# Altium schematic sheet AD9959.SchDoc: AD9959 4-Channel 500M DDS Module
size A3; Date: 2022.4.26; ApprovedBy: Pablo; CheckedBy: Pablo; Author: Pablo; CompanyName: STI; DrawnBy: Pablo; Engineer: Pablo; Organization: STI; DocumentNumber: 1; Revision: 1; SheetNumber: 1; SheetTotal: 1; Time: 2022.4.26
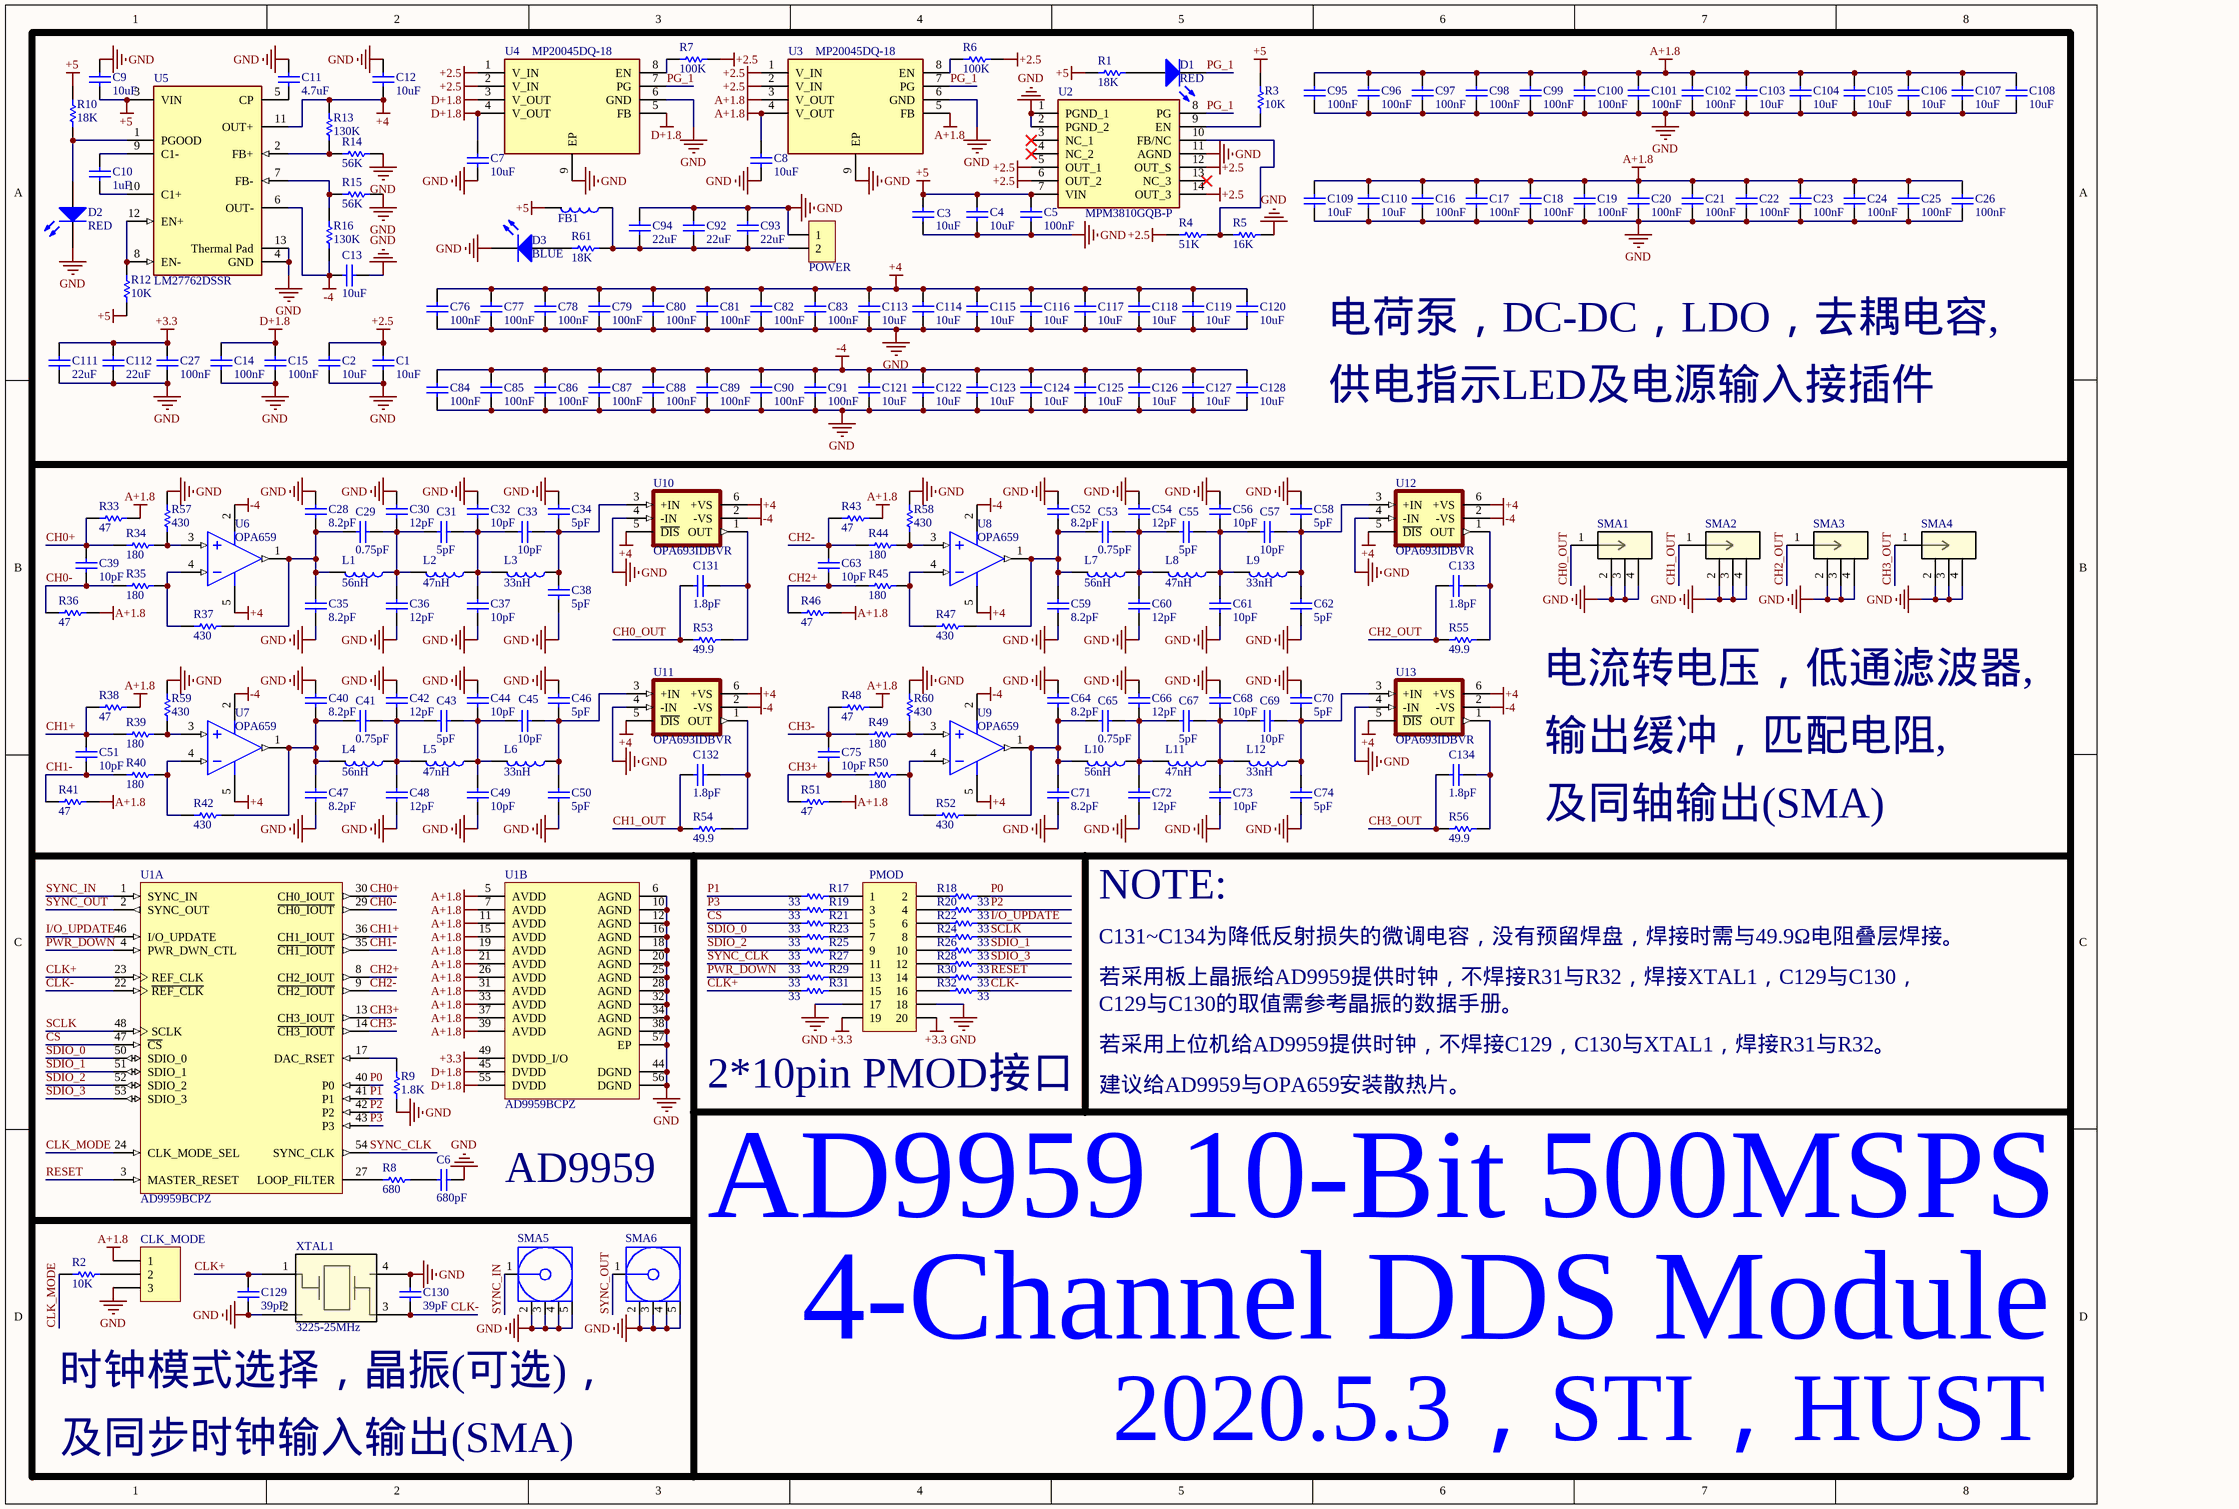
[diagram p0: AD9959.SchDoc]

## Parts
C1  10uF  [1608[0603]]
C2  10uF  [1608[0603]]
C3  10uF  [1608[0603]]
C4  10uF  [1608[0603]]
C5  100nF  [0402]
C6  680pF  [0402]
C7  10uF  [1608[0603]]
C8  10uF  [1608[0603]]
C9  10uF  [1608[0603]]
C10  1uF  [0402]
C11  4.7uF  [1608[0603]]
C12  10uF  [1608[0603]]
C13  10uF  [1608[0603]]
C14  100nF  [0402]
C15  100nF  [0402]
C16  100nF  [0402]
C17  100nF  [0402]
C18  100nF  [0402]
C19  100nF  [0402]
C20  100nF  [0402]
C21  100nF  [0402]
C22  100nF  [0402]
C23  100nF  [0402]
C24  100nF  [0402]
C25  100nF  [0402]
C26  100nF  [0402]
C27  100nF  [0402]
C28  8.2pF  [0402]
C29  0.75pF  [0402]
C30  12pF  [0402]
C31  5pF  [0402]
C32  10pF  [0402]
C33  10pF  [0402]
C34  5pF  [0402]
C35  8.2pF  [0402]
C36  12pF  [0402]
C37  10pF  [0402]
C38  5pF  [0402]
C39  10pF  [0402]
C40  8.2pF  [0402]
C41  0.75pF  [0402]
C42  12pF  [0402]
C43  5pF  [0402]
C44  10pF  [0402]
C45  10pF  [0402]
C46  5pF  [0402]
C47  8.2pF  [0402]
C48  12pF  [0402]
C49  10pF  [0402]
C50  5pF  [0402]
C51  10pF  [0402]
C52  8.2pF  [0402]
C53  0.75pF  [0402]
C54  12pF  [0402]
C55  5pF  [0402]
C56  10pF  [0402]
C57  10pF  [0402]
C58  5pF  [0402]
C59  8.2pF  [0402]
C60  12pF  [0402]
C61  10pF  [0402]
C62  5pF  [0402]
C63  10pF  [0402]
C64  8.2pF  [0402]
C65  0.75pF  [0402]
C66  12pF  [0402]
C67  5pF  [0402]
C68  10pF  [0402]
C69  10pF  [0402]
C70  5pF  [0402]
C71  8.2pF  [0402]
C72  12pF  [0402]
C73  10pF  [0402]
C74  5pF  [0402]
C75  10pF  [0402]
C76  100nF  [0402]
C77  100nF  [0402]
C78  100nF  [0402]
C79  100nF  [0402]
C80  100nF  [0402]
C81  100nF  [0402]
C82  100nF  [0402]
C83  100nF  [0402]
C84  100nF  [0402]
C85  100nF  [0402]
C86  100nF  [0402]
C87  100nF  [0402]
C88  100nF  [0402]
C89  100nF  [0402]
C90  100nF  [0402]
C91  100nF  [0402]
C92  22uF  [6-0805_L]
C93  22uF  [6-0805_L]
C94  22uF  [6-0805_L]
C95  100nF  [0402]
C96  100nF  [0402]
C97  100nF  [0402]
C98  100nF  [0402]
C99  100nF  [0402]
C100  100nF  [0402]
C101  100nF  [0402]
C102  100nF  [0402]
C103  10uF  [0402]
C104  10uF  [0402]
C105  10uF  [0402]
C106  10uF  [0402]
C107  10uF  [0402]
C108  10uF  [0402]
C109  10uF  [0402]
C110  10uF  [0402]
C111  22uF  [6-0805_L]
C112  22uF  [6-0805_L]
C113  10uF  [0402]
C114  10uF  [0402]
C115  10uF  [0402]
C116  10uF  [0402]
C117  10uF  [0402]
C118  10uF  [0402]
C119  10uF  [0402]
C120  10uF  [0402]
C121  10uF  [0402]
C122  10uF  [0402]
C123  10uF  [0402]
C124  10uF  [0402]
C125  10uF  [0402]
C126  10uF  [0402]
C127  10uF  [0402]
C128  10uF  [0402]
C129  39pF  [0402]
C130  39pF  [0402]
C131  1.8pF  [0402]
C132  1.8pF  [0402]
C133  1.8pF  [0402]
C134  1.8pF  [0402]
CLK_MODE  Header 3  [HDR1X3]  (value not drawn)
D1  RED  [1608[0603]]
D2  RED  [1608[0603]]
D3  BLUE  [1608[0603]]
FB1  100R,100MHz, 0603  [1608[0603]]  (value not drawn)
L1  56nH  [0402]
L2  47nH  [0402]
L3  33nH  [0402]
L4  56nH  [0402]
L5  47nH  [0402]
L6  33nH  [0402]
L7  56nH  [0402]
L8  47nH  [0402]
L9  33nH  [0402]
L10  56nH  [0402]
L11  47nH  [0402]
L12  33nH  [0402]
PMOD  Header 2X10  [201R2X10]  (value not drawn)
POWER  HDR-1X2  [KF2510-LI-2P]  (value not drawn)
R1  18K  [0402]
R2  10K  [0402]
R3  10K  [0402]
R4  51K  [0402]
R5  16K  [0402]
R6  100K  [0402]
R7  100K  [0402]
R8  680  [0402]
R9  1.8K  [0402]
R10  18K  [0402]
R12  10K  [0402]
R13  130K  [0402]
R14  56K  [0402]
R15  56K  [0402]
R16  130K  [0402]
R17  33  [0402]
R18  33  [0402]
R19  33  [0402]
R20  33  [0402]
R21  33  [0402]
R22  33  [0402]
R23  33  [0402]
R24  33  [0402]
R25  33  [0402]
R26  33  [0402]
R27  33  [0402]
R28  33  [0402]
R29  33  [0402]
R30  33  [0402]
R31  33  [0402]
R32  33  [0402]
R33  47  [0402]
R34  180  [0402]
R35  180  [0402]
R36  47  [0402]
R37  430  [0402]
R38  47  [0402]
R39  180  [0402]
R40  180  [0402]
R41  47  [0402]
R42  430  [0402]
R43  47  [0402]
R44  180  [0402]
R45  180  [0402]
R46  47  [0402]
R47  430  [0402]
R48  47  [0402]
R49  180  [0402]
R50  180  [0402]
R51  47  [0402]
R52  430  [0402]
R53  49.9  [0402]
R54  49.9  [0402]
R55  49.9  [0402]
R56  49.9  [0402]
R57  430  [0402]
R58  430  [0402]
R59  430  [0402]
R60  430  [0402]
R61  18K  [0402]
SMA1  132414  [CONN_132414_AMP]  (value not drawn)
SMA2  132414  [CONN_132414_AMP]  (value not drawn)
SMA3  132414  [CONN_132414_AMP]  (value not drawn)
SMA4  132414  [CONN_132414_AMP]  (value not drawn)
SMA5  5-1814832-1  [TECO-5-1814832-1_V]  (value not drawn)
SMA6  5-1814832-1  [TECO-5-1814832-1_V]  (value not drawn)
U1  AD9959BCPZ  [ADI-CP-56-1_L]  (parts A,B of 2)
U2  MPM3810GQB-P  [MPM3810GQB33Z]
U3  MP20045DQ-18  [SON65P300X300X100-9N]
U4  MP20045DQ-18  [SON65P300X300X100-9N]
U5  LM27762DSSR  [FP-DSS0012B-IPC_A]
U6  OPA659  [DBV0005A_L]
U7  OPA659  [DBV0005A_L]
U8  OPA659  [DBV0005A_L]
U9  OPA659  [DBV0005A_L]
U10  OPA693IDBVR  [SOT95P280X145-6N]
U11  OPA693IDBVR  [SOT95P280X145-6N]
U12  OPA693IDBVR  [SOT95P280X145-6N]
U13  OPA693IDBVR  [SOT95P280X145-6N]
XTAL1  3225-25MHz  [NX3225GA-16.000M-STD-CRG-2_NDK]

## Nets
+2.5: C1.2 C2.2 R4.2 R6.2 R7.2 U2.5(OUT_1) U2.6(OUT_2) U2.12(OUT_S) U2.14(OUT_3) U3.1(V_IN) U3.2(V_IN) U4.1(V_IN) U4.2(V_IN)
+3.3: C27.1 C111.1 C112.1 PMOD.19 PMOD.20 U1.49(DVDD_I/O)
+4: C12.1 C76.1 C77.1 C78.1 C79.1 C80.1 C81.1 C82.1 C83.1 C113.1 C114.1 C115.1 C116.1 C117.1 C118.1 C119.1 C120.1 R13.1 U5.11(OUT+) U6.5(VS+) U7.5(VS+) U8.5(VS+) U9.5(VS+) U10.5(~{DIS}) U10.6(+VS) U11.5(~{DIS}) U11.6(+VS) U12.5(~{DIS}) U12.6(+VS) U13.5(~{DIS}) U13.6(+VS)
+5: C3.1 C4.1 C5.1 C9.2 FB1.2 R1.2 R3.2 R10.2 R12.1 U2.7(VIN) U5.3(VIN)
-4: C13.2 C84.1 C85.1 C86.1 C87.1 C88.1 C89.1 C90.1 C91.1 C121.1 C122.1 C123.1 C124.1 C125.1 C126.1 C127.1 C128.1 R16.2 U5.6(OUT-) U6.2(VS-) U7.2(VS-) U8.2(VS-) U9.2(VS-) U10.2(-VS) U11.2(-VS) U12.2(-VS) U13.2(-VS)
A+1.8: C8.1 C16.1 C17.1 C18.1 C19.1 C20.1 C21.1 C22.1 C23.1 C24.1 C25.1 C26.1 C95.1 C96.1 C97.1 C98.1 C99.1 C100.1 C101.1 C102.1 C103.1 C104.1 C105.1 C106.1 C107.1 C108.1 C109.1 C110.1 CLK_MODE.1 R33.1 R36.2 R38.1 R41.2 R43.1 R46.2 R48.1 R51.2 U1.5(AVDD) U1.7(AVDD) U1.11(AVDD) U1.15(AVDD) U1.19(AVDD) U1.21(AVDD) U1.26(AVDD) U1.31(AVDD) U1.33(AVDD) U1.37(AVDD) U1.39(AVDD) U3.3(V_OUT) U3.4(V_OUT) U3.5(FB)
D+1.8: C7.1 C14.1 C15.1 U1.45(DVDD) U1.55(DVDD) U4.3(V_OUT) U4.4(V_OUT) U4.5(FB)
GND: C1.1 C2.1 C3.2 C4.2 C5.2 C6.1 C7.2 C8.2 C9.1 C11.2 C12.2 C13.1 C14.2 C15.2 C16.2 C17.2 C18.2 C19.2 C20.2 C21.2 C22.2 C23.2 C24.2 C25.2 C26.2 C27.2 C28.1 C30.1 C32.1 C34.2 C35.2 C36.2 C37.2 C38.1 C40.1 C42.1 C44.1 C46.2 C47.2 C48.2 C49.2 C50.1 C52.1 C54.1 C56.1 C58.2 C59.2 C60.2 C61.2 C62.1 C64.1 C66.1 C68.1 C70.2 C71.2 C72.2 C73.2 C74.1 C76.2 C77.2 C78.2 C79.2 C80.2 C81.2 C82.2 C83.2 C84.2 C85.2 C86.2 C87.2 C88.2 C89.2 C90.2 C91.2 C92.2 C93.2 C94.2 C95.2 C96.2 C97.2 C98.2 C99.2 C100.2 C101.2 C102.2 C103.2 C104.2 C105.2 C106.2 C107.2 C108.2 C109.2 C110.2 C111.2 C112.2 C113.2 C114.2 C115.2 C116.2 C117.2 C118.2 C119.2 C120.2 C121.2 C122.2 C123.2 C124.2 C125.2 C126.2 C127.2 C128.2 C129.1 C130.1 CLK_MODE.3 D2.2(K) D3.2(K) PMOD.17 PMOD.18 POWER.1 R5.1 R9.2 R14.1 R15.1 R57.2 R58.2 R59.2 R60.2 SMA1.2 SMA1.3 SMA1.4 SMA2.2 SMA2.3 SMA2.4 SMA3.2 SMA3.3 SMA3.4 SMA4.2 SMA4.3 SMA4.4 SMA5.2 SMA5.3 SMA5.4 SMA5.5 SMA6.2 SMA6.3 SMA6.4 SMA6.5 U1.6(AGND) U1.10(AGND) U1.12(AGND) U1.16(AGND) U1.18(AGND) U1.20(AGND) U1.25(AGND) U1.28(AGND) U1.32(AGND) U1.34(AGND) U1.38(AGND) U1.44(DGND) U1.56(DGND) U1.57(EP) U2.1(PGND_1) U2.2(PGND_2) U2.11(AGND) U3.6(GND) U3.9(EP) U4.6(GND) U4.9(EP) U5.4(GND) U5.13(Thermal_Pad) U10.4(-IN) U11.4(-IN) U12.4(-IN) U13.4(-IN) XTAL1.2 XTAL1.4
CH0+: C39.2 R33.2 R34.1 U1.30(CH0_IOUT)
CH0-: C39.1 R35.1 R36.1 U1.29(~{CH0_IOUT})
CH0_OUT: C131.2 R53.2 SMA1.1
CH1+: C51.2 R38.2 R39.1 U1.36(CH1_IOUT)
CH1-: C51.1 R40.1 R41.1 U1.35(~{CH1_IOUT})
CH1_OUT: C132.2 R54.2 SMA2.1
CH2+: C63.1 R45.1 R46.1 U1.8(CH2_IOUT)
CH2-: C63.2 R43.2 R44.1 U1.9(~{CH2_IOUT})
CH2_OUT: C133.2 R55.2 SMA3.1
CH3+: C75.1 R50.1 R51.1 U1.13(CH3_IOUT)
CH3-: C75.2 R48.2 R49.1 U1.14(~{CH3_IOUT})
CH3_OUT: C134.2 R56.2 SMA4.1
CLK+: C129.2 R31.2 U1.23(REF_CLK) XTAL1.1
CLK-: C130.2 R32.1 U1.22(~{REF_CLK}) XTAL1.3
CLK_MODE: R2.1 U1.24(CLK_MODE_SEL)
CS: R21.2 U1.47(~{CS})
I/O_UPDATE: R22.1 U1.46(I/O_UPDATE)
P0: R18.1 U1.40(P0)
P1: R17.2 U1.41(P1)
P2: R20.1 U1.42(P2)
P3: R19.2 U1.43(P3)
PG_1: D1.2(K) U2.8(PG) U3.7(PG) U4.7(PG)
PWR_DOWN: R29.2 U1.4(PWR_DWN_CTL)
RESET: R30.1 U1.3(MASTER_RESET)
SCLK: R24.1 U1.48(SCLK)
SDIO_0: R23.2 U1.50(SDIO_0)
SDIO_1: R26.1 U1.51(SDIO_1)
SDIO_2: R25.2 U1.52(SDIO_2)
SDIO_3: R28.1 U1.53(SDIO_3)
SYNC_CLK: R27.2 U1.54(SYNC_CLK)
SYNC_IN: SMA5.1 U1.1(SYNC_IN)
SYNC_OUT: SMA6.1 U1.2(SYNC_OUT)
NetC6_2: C6.2 R8.2
NetC10_1: C10.1 U5.10(C1+)
NetC10_2: C10.2 U5.9(C1-)
NetC11_1: C11.1 U5.5(CP)
NetC28_2: C28.2 C29.1 C35.1 L1.2 R37.2 U6.1(OUT)
NetC29_2: C29.2 C30.2 C31.1 C36.1 L1.1 L2.2
NetC31_2: C31.2 C32.2 C33.1 C37.1 L2.1 L3.2
NetC33_2: C33.2 C34.1 C38.2 L3.1 U10.3(+IN)
NetC40_2: C40.2 C41.1 C47.1 L4.2 R42.2 U7.1(OUT)
NetC41_2: C41.2 C42.2 C43.1 C48.1 L4.1 L5.2
NetC43_2: C43.2 C44.2 C45.1 C49.1 L5.1 L6.2
NetC45_2: C45.2 C46.1 C50.2 L6.1 U11.3(+IN)
NetC52_2: C52.2 C53.1 C59.1 L7.2 R47.2 U8.1(OUT)
NetC53_2: C53.2 C54.2 C55.1 C60.1 L7.1 L8.2
NetC55_2: C55.2 C56.2 C57.1 C61.1 L8.1 L9.2
NetC57_2: C57.2 C58.1 C62.2 L9.1 U12.3(+IN)
NetC64_2: C64.2 C65.1 C71.1 L10.2 R52.2 U9.1(OUT)
NetC65_2: C65.2 C66.2 C67.1 C72.1 L10.1 L11.2
NetC67_2: C67.2 C68.2 C69.1 C73.1 L11.1 L12.2
NetC69_2: C69.2 C70.1 C74.2 L12.1 U13.3(+IN)
NetC92_1: C92.1 C93.1 C94.1 FB1.1 POWER.2 R61.1
NetC131_1: C131.1 R53.1 U10.1(OUT)
NetC132_1: C132.1 R54.1 U11.1(OUT)
NetC133_1: C133.1 R55.1 U12.1(OUT)
NetC134_1: C134.1 R56.1 U13.1(OUT)
NetCLK_MODE_2: CLK_MODE.2 R2.2
NetD1_1: D1.1(A) R1.1
NetD2_1: D2.1(A) R10.1 U5.1(PGOOD)
NetD3_1: D3.1(A) R61.2
NetPMOD_1: PMOD.1 R17.1
NetPMOD_2: PMOD.2 R18.2
NetPMOD_3: PMOD.3 R19.1
NetPMOD_4: PMOD.4 R20.2
NetPMOD_5: PMOD.5 R21.1
NetPMOD_6: PMOD.6 R22.2
NetPMOD_7: PMOD.7 R23.1
NetPMOD_8: PMOD.8 R24.2
NetPMOD_9: PMOD.9 R25.1
NetPMOD_10: PMOD.10 R26.2
NetPMOD_11: PMOD.11 R27.1
NetPMOD_12: PMOD.12 R28.2
NetPMOD_13: PMOD.13 R29.1
NetPMOD_14: PMOD.14 R30.2
NetPMOD_15: PMOD.15 R31.1
NetPMOD_16: PMOD.16 R32.2
NetR3_1: R3.1 U2.9(EN)
NetR4_1: R4.1 R5.2 U2.10(FB/NC)
NetR6_1: R6.1 U3.8(EN)
NetR7_1: R7.1 U4.8(EN)
NetR8_1: R8.1 U1.27(LOOP_FILTER)
NetR9_1: R9.1 U1.17(DAC_RSET)
NetR12_2: R12.2 U5.8(EN-) U5.12(EN+)
NetR13_2: R13.2 R14.2 U5.2(FB+)
NetR15_2: R15.2 R16.1 U5.7(FB-)
NetR34_2: R34.2 R57.1 U6.3(IN+)
NetR35_2: R35.2 R37.1 U6.4(IN-)
NetR39_2: R39.2 R59.1 U7.3(IN+)
NetR40_2: R40.2 R42.1 U7.4(IN-)
NetR44_2: R44.2 R58.1 U8.3(IN+)
NetR45_2: R45.2 R47.1 U8.4(IN-)
NetR49_2: R49.2 R60.1 U9.3(IN+)
NetR50_2: R50.2 R52.1 U9.4(IN-)

Not connected (* = marked no-connect by the designer): U2 3(NC_1)* 4(NC_2)* 13(NC_3)*

## Notes on the sheet
- 电荷泵，DC-DC，LDO，去耦电容,
- 供电指示LED及电源输入接插件
- 电流转电压，低通滤波器,
- 输出缓冲，匹配电阻,
- 及同轴输出(SMA)
- NOTE:
- C131~C134为降低反射损失的微调电容，没有预留焊盘，焊接时需与49.9Ω电阻叠层焊接。
- 若采用板上晶振给AD9959提供时钟，不焊接R31与R32，焊接XTAL1，C129与C130，
- C129与C130的取值需参考晶振的数据手册。
- 若采用上位机给AD9959提供时钟，不焊接C129，C130与XTAL1，焊接R31与R32。
- (near PMOD) 2*10pin PMOD接口
- 建议给AD9959与OPA659安装散热片。
- AD9959
- (near SMA6) AD9959 10-Bit 500MSPS
- 时钟模式选择，晶振(可选)，
- 4-Channel DDS Module
- 及同步时钟输入输出(SMA)
- 2020.5.3，STI，HUST
- Title:
- Size:
- Date:
- A4
- No.:
- Sheet           of
- Revision:
- Author:
- File:

## Library data of the parts
C1-C134 = CAP: Capacitor; Value: 104; Published: 8-Jun-2000; LatestRevisionDate: 17-Jul-2002; LatestRevisionNote: Re-released for DXP Platform.; PackageReference: RAD-0.3; Publisher: Altium Limited
CLK_MODE = Header 3: Header, 3-Pin; LatestRevisionDate: 17-Jul-2002; LatestRevisionNote: Re-released for DXP Platform.; Publisher: Altium Limited
D1-D3 = LED0: Typical INFRARED GaAs LED; Published: 8-Jun-2000; LatestRevisionDate: 08-Jul-2005; LatestRevisionNote: Mech Layer 1 removed.; PackageReference: LED-0; Publisher: Altium Limited; PackageDescription: LED; 2 Leads
FB1 L1-L12 = FB: 磁珠
PMOD = Header 10X2: 10*2P接插件; 淘宝ID: 小糖豆的小窝窝; BOM名称: 10*2P接插件; 下单链接: https://item.taobao.com/item.htm?ft=t&id=613637044352
POWER = Header 2: 2P接插件; 淘宝ID: 小糖豆的小窝窝; BOM名称: 2P接插件; 下单链接: https://item.taobao.com/item.htm?ft=t&id=613637044352
R1-R10 R12-R61 = RES: Resistor; Value: 1K; Published: 8-Jun-2000; Revision: July-2002: Re-released for DXP Platform.; Publisher: Altium Limited
SMA1-SMA4 = 132414: No Description Available; Mfr_Name: Amphenol ICC; Copyright: Copyright (C) 2022 Ultra Librarian. All rights reserved.; Manufacturer_Part_Number: 132414; RefDes: RefDes; Type: DEV
SMA5 SMA6 = CMP-2000-05415-1: SMA Connector, Pitch 5.08 mm, 1 Position, Height 9.5 mm, Tail Length 4 mm, -65 to 165 degC, RoHS, Bulk; Manufacturer: TE Connectivity; Connector Mounting: PCBMount; Connector Body Style: StraightJack; Impedance: 50ohm; Coaxial Termination: Solder; SVHC: NoSVHC(15-Jun-2015); Frequency Max: 3GHz; Product Range: ZDCSeries; Connector Type: SMACoaxial; Datasheet Version: Rev. B1, 03/2011; Package Reference: 5-1814832-1; Package Description: SMA Connector, Pitch 5.08 mm, 1 Position, Height 9.5 mm, Tail Length 4 mm; Contact Plating: GoldPlatedContacts; Coaxial Cable Types: -; Contact Material: BerylliumCopper; Manufacturer URL: http://www.te.com/; Datasheet URL: http://www.onlinecomponents.com/productFiles/mf-AMP/eng_cd_1814832_a.pdf
U1 = CMP-0293-00014-1: 4-Channel, 500 MSPS DDS with 10-Bit DACs, Serial, CP-56-1, 260 Tray, Pb-Free; Tuning Word Width (bits): 32bit; Master fclk: 500MHz; Compliance Range (V): 2.3V; FS Iout (mA nom): 10mA; REFCLK Multiplier: Yes; I Supply total (max): 180mA; Resolution (Bits): 10bit; ComponentLink3URL: http://www.analog.com/static/imported-files/packages/32698137492825CP_56_1.pdf; PackageDescription: 56-Lead Lead Frame Chip Scale Package [LFCSP_VQ]; DatasheetVersion: Rev. B; ComponentLink1URL: www.analog.com; PackageVersion: 112805-0; ComponentLink1Description: Manufacturer URL; ComponentLink2Description: Datasheet; Code_JEDEC: MO-220-VLLD-2; ComponentLink2URL: http://www.analog.com/static/imported-files/data_sheets/AD9959.pdf; PackageReference: CP-56-1; I/O Interface: Serial; ComponentLink3Description: Package Specification
U2 = MPM3810GQB-P: Integrated Circuit; Manufacturer_Name: Monolithic Power Systems (MPS); Datasheet Link: https://www.monolithicpower.com/pub/media/document/MPM3810_r1.1.pdf; Height: 1mm; Manufacturer_Part_Number: MPM3810GQB-P; Mouser Part Number: 946-MPM3810GQBP; Mouser Price/Stock: https://www.mouser.co.uk/ProductDetail/Monolithic-Power-Systems-MPS/MPM3810GQB-P?qs=QEkzKklKf2S%252BUubfiGImEA%3D%3D
U3 U4 = MP20045DN-33-LF-Z: Integrated Circuit; Manufacturer_Name: Monolithic Power Systems (MPS); Datasheet Link: https://www.mouser.fr/datasheet/2/277/MP20045-1384244.pdf; Height: 1.7mm; Manufacturer_Part_Number: MP20045DN-33-LF-Z
U5 = CMP-04918-000139-2: IC REG CHARGE PUMP ADJ DL 12WSON; Min Output Voltage: 1.5V; Max Input Voltage: 5.5V; Synchronous Rectifier: No; Output Type: Adjustable; Output Current: 250mA; Min Input Voltage: 2.7V; Quiescent Current: 390uA; Switching Frequency: 2.3MHz; Max Output Voltage: 5V; Topology: Charge Pump; Lead Free: Lead Free; Min Operating Temperature: -40°C; Max Operating Temperature: 85°C; RoHS Compliant: Yes; Packaging: Tape and Reel; Mount: Surface Mount
U6-U9 = CMP-0018-00409-2: 650 MHz Unity Gain Stable JFET Input Amplifier, 7 to 13 V, -40 to 85 degC, 5-pin SOT23 (DBV5), Green (RoHS & no Sb/Br); Manufacturer: Texas Instruments; PartNumber: OPA659IDBVT; 2nd Harmonic(dBc): 79; Slew Rate(Typ)(V/us): 2550; @ MHz: 10; Iib(Max)(nA): 1.2; Acl, min stable gain(V/V): 2; BW @ Acl(MHz): 650; Vs(Min)(V): 7; THD (Fc is 1 MHz)(Typ)(dB): -78; Sub Family: High Output Current Amplifier (>=50mA), High Speed Amplifier (>=50MHz); Io(Typ)(mA): 70; 3rd Harmonic(dBc): 100; Vio(Max)(mV): 5; Vn at Flatband(Typ)(nV/rtHz): 8.9; Vs(Max)(V): 13; Iq per channel(Max)(mA): 33.5; Number of Channels: 1; ComponentLink3Description: Package Specification; Code_JEDEC: MO-178; PackageDescription: 5-Pin Plastic Small Outline, Body 1.6 x 2.9 mm, Pitch 0.95 mm; PackageVersion: 4073253-4/K, 03/2006; ComponentLink2Description: Datasheet; ComponentLink3URL: http://www.ti.com/litv/pdf/mpds018i; ComponentLink1Description: Manufacturer URL; PackageReference: DBV0005A; Eco-Plan: Green (RoHS & no Sb/Br); ComponentLink1URL: http://www.ti.com/; Mounting Technology: Surface Mount; ComponentLink2URL: http://www.ti.com/general/docs/lit/getliterature.tsp?genericPartNumber=OPA659&fileType=pdf; DatasheetVersion: SBOS342B
U10-U13 = OPA693IDBVR: Ultra-Wideband, Fixed Gain Video Buffer Amplifier with Disable; MF: Texas Instruments; Availability: In Stock; Package: SOT-23-6 Texas Instruments; MP: OPA693IDBVR; Value: *; Purchase-URL: https://pricing.snapeda.com/search/part/OPA693IDBVR/?ref=eda; SnapEDA_Link: https://www.snapeda.com/parts/OPA693IDBVR/Texas+Instruments/view-part/?ref=snap; Price: None; Check_prices: https://www.snapeda.com/parts/OPA693IDBVR/Texas+Instruments/view-part/?ref=eda
XTAL1 = NX3225GA-16.000M-STD-CRG-2: No Description Available; Mfr_Name: NDK; Copyright: Copyright (C) 2022 Ultra Librarian. All rights reserved.; Manufacturer_Part_Number: NX3225GA-16.000M-STD-CRG-2; RefDes: RefDes; Type: DEV